# Altium project ProjectAgricultureSensor.PrjPcb
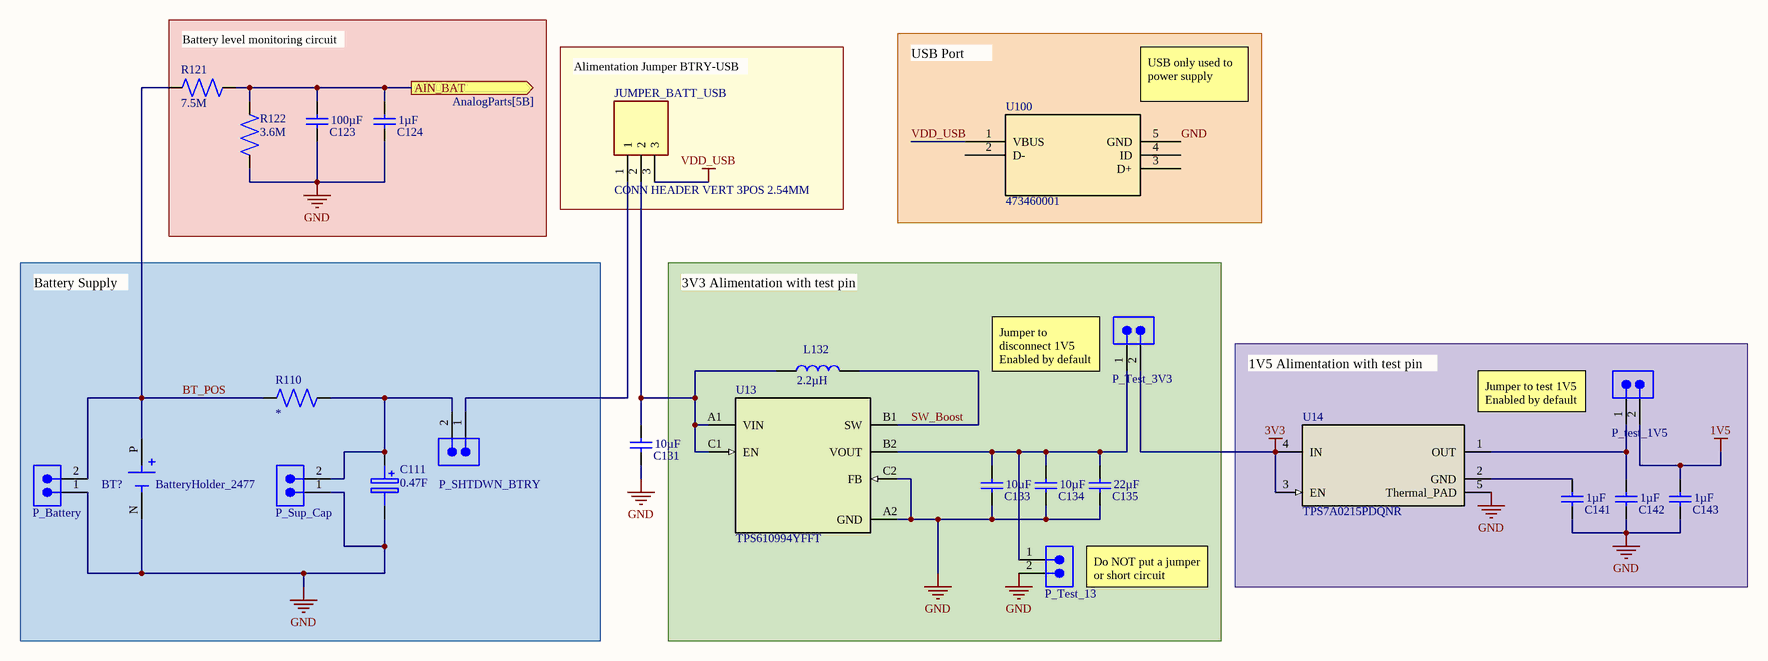
[diagram p0: PowerElectronics.SchDoc]
4 sheets, 150 parts. Net scope: flat (ports and power ports of the same name join across sheets).
Board file: PcbLayout.PcbDoc
Sheets:
  PowerElectronics.SchDoc
  AnalogParts.SchDoc
  Processor.SchDoc
  RF_antenna.SchDoc

## Sheet PowerElectronics.SchDoc
size 381 x 241 mm; SheetNumber: 1; SheetTotal: 4

### Parts
BT?  BatteryHolder_2477  [BatteryHolder2477]
C111  0.47F  [TH_SUPCAP_PHVL3R9V474R]
C123  100µF  [CAPC1608X06L]
C124  1µF  [CAPC1608X06L]
C131  10µF  [CAPC1608X06L]
C133  10µF  [CAPC1608X06L]
C134  10µF  [CAPC1608X06L]
C135  22µF  [CAPC1608X06L]
C141  1µF  [CAPC1608X06L]
C142  1µF  [CAPC1608X06L]
C143  1µF  [CAPC1608X06L]
JUMPER_BATT_USB  CONN HEADER VERT 3POS 2.54MM  [CONN HEADER VERT 3POS 2.54MM]
L132  2.2µH  [INDC2016X10CX]
P_Battery  Pin header 2p  [Pin_header_1x2]  (value not drawn)
P_SHTDWN_BTRY  Pin header 2p  [Pin_header_1x2]  (value not drawn)
P_Sup_Cap  Pin header 2p  [Pin_header_1x2]  (value not drawn)
P_test_1V5  Pin header 2p  [Pin_header_1x2]  (value not drawn)
P_Test_3V3  Pin header 2p  [Pin_header_1x2]  (value not drawn)
P_Test_13  Pin header 2p  [Pin_header_1x2]  (value not drawn)
R110  *  [RESC1608X04.5L]
R121  7.5M  [RESC1608X04.5L]
R122  3.6M  [RESC1608X04.5L]
U13  TPS610994YFFT  [YFF0006AFAD]
U14  TPS7A0215PDQNR  [DQN0004A-MFG]
U100  473460001  [47346-0001_MOL]

### Ports
AIN_BAT (out, see AnalogParts[5B])

### Nets
1V5: C143.2 P_test_1V5.2
3V3: P_Test_3V3.2 U14.3(EN) U14.4(IN)
GND: BT?.N(NEG) C111.1(-) C123.1 C124.1 C131.1 C133.1 C134.1 C135.1 C141.1 C142.1 C143.1 P_Battery.1 P_Sup_Cap.1 P_Test_13.2 R122.2 U13.A2(GND) U13.C2(FB) U14.5(Thermal_PAD) U100.5(GND)
VDD_USB: JUMPER_BATT_USB.3 U100.1(VBUS)
ANALOG1: C123.2 C124.2 R121.2 R122.1 ; port AIN_BAT
BT_POS: BT?.P(POS) P_Battery.2 R110.1 R121.1
SW_Boost: L132.2 U13.B1(SW)
NetC111_2: C111.2(+) P_SHTDWN_BTRY.2 P_Sup_Cap.2 R110.2
NetC131_2: C131.2 JUMPER_BATT_USB.2 L132.1 U13.A1(VIN) U13.C1(EN)
NetC133_2: C133.2 C134.2 C135.2 P_Test_3V3.1 P_Test_13.1 U13.B2(VOUT)
NetC141_2: C141.2 U14.2(GND)
NetC142_2: C142.2 P_test_1V5.1 U14.1(OUT)
NetJUMPER_BATT_USB_1: JUMPER_BATT_USB.1 P_SHTDWN_BTRY.1

Not connected (* = marked no-connect by the designer): U100 2(D-) 3(D+) 4(ID)

### Notes on the sheet
- (near R121) Battery level monitoring circuit
- Alimentation Jumper BTRY-USB
- USB Port
- (near U100) USB only used to power supply
- Battery Supply
- 3V3 Alimentation with test pin
- (near P_Test_3V3) Jumper to disconnect 1V5
  Enabled by default
- 1V5 Alimentation with test pin
- Jumper to test 1V5
  Enabled by default
- Do NOT put a jumper or short circuit

### Library data of the parts
BT? = BatteryHolder_2477: Battery holder for coin battery, modello BH1000G; Value: BatteryHolder_2477
C111 = PHVL-3R9V474-R: Supercapacitors 0.47F, 3.9V working voltage, 5V surge voltage, 1µA leak current; Value: 0.47F
C123 C124 C131 C133-C135 = C0603-4µ7: Capacitor, X5R, ±10%; Value: 4.7µF
C141-C143 = C0603-4µ7: Capacitor, X5R, ±10%; Value: 1µF
JUMPER_BATT_USB = CONN HEADER VERT 3POS 2.54MM: Connector; Manufacturer_Name: Wurth Elektronik; Manufacturer_Part_Number: 61300311121; Datasheet Link: http://katalog.we-online.de/em/datasheet/6130xx11121.pdf; Height: 8.69mm; Mouser Part Number: 710-61300311121; Mouser Price/Stock: https://www.mouser.co.uk/ProductDetail/Wurth-Elektronik/61300311121?qs=PhR8RmCirEYxRWFJzNKsUw%3D%3D
L132 = L0806-2µ2-1.53A-163mOhm-TDK: Shielded wirewound Inductor 1.53 A 163mOhm, ±20%; MF: TDK Corporation; MP: VLS201610CX-2R2M-1; Check_prices: https://www.snapeda.com/parts/VLS201610CX-2R2M-1/TDK/view-part/?ref=eda; Price: None; Availability: In Stock; SnapEDA_Link: https://www.snapeda.com/parts/VLS201610CX-2R2M-1/TDK/view-part/?ref=snap; Value: 2.2µH; Package: NON STANDARD-2 TDK; Purchase-URL: https://pricing.snapeda.com/search/part/VLS201610CX-2R2M-1/?ref=eda
P_Battery P_SHTDWN_BTRY P_Sup_Cap P_test_1V5 P_Test_3V3 P_Test_13 = Pin header 2p: Pin Header, THT, Vertical, pitch 2.54mm, 1 Row, 2P; Value: Pin header 2p
R110 R121 R122 = R0603: Resistor, ±1%, 0.063W; Value: *
U13 = TPS610994YFFT: No Description Available; Mfr_Name: Texas Instruments; TYPE: TYPE; RefDes: RefDes
U14 = TPS7A0215PDQNR: No Description Available; Mfr_Name: Texas Instruments; TYPE: TYPE; RefDes: RefDes
U100 = 473460001: No Description Available; Mfr_Name: Molex Connector Corporation; RefDes: RefDes; Type: Type

## Sheet AnalogParts.SchDoc
size 381 x 241 mm; SheetNumber: 2; SheetTotal: 4
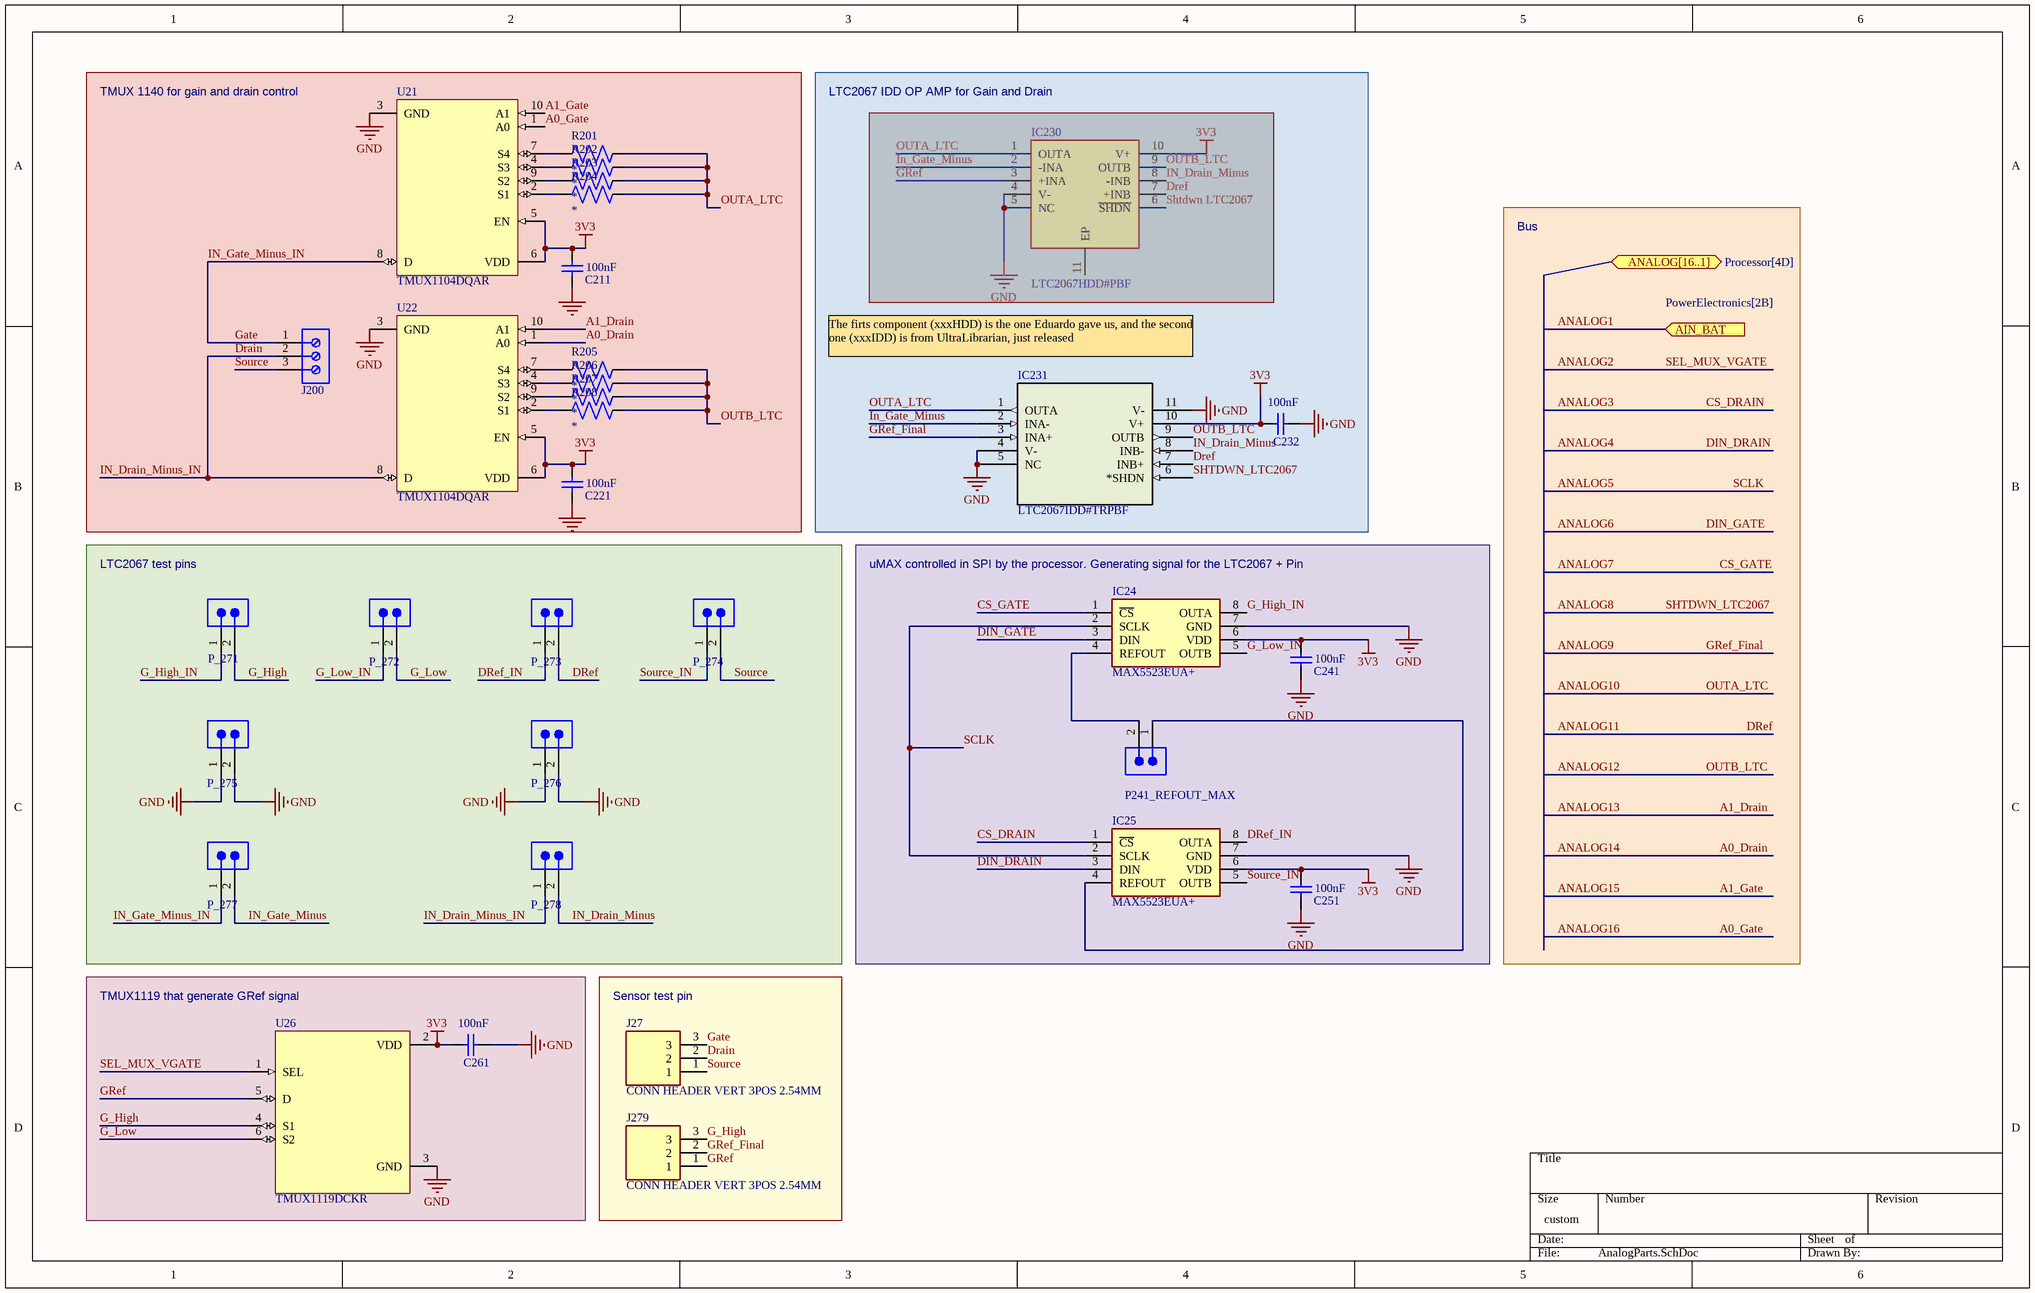
[diagram p1: AnalogParts.SchDoc]

### Parts
C211  100nF  [CAPC1608X06L]
C221  100nF  [CAPC1608X06L]
C232  100nF  [CAPC1608X06L]
C241  100nF  [CAPC1608X06L]
C251  100nF  [CAPC1608X06L]
C261  100nF  [CAPC1608X06L]
IC24  MAX5523EUA+  [MAX5523EUA+]
IC25  MAX5523EUA+  [MAX5523EUA+]
IC230  LTC2067HDD#PBF  [LTC2067HDD#PBF]  (masked out: inside a compile mask, not in the netlist)
IC231  LTC2067IDD#TRPBF  [05-08-1699_ADI]
J27  CONN HEADER VERT 3POS 2.54MM  [CONN HEADER VERT 3POS 2.54MM]
J200  691210910003  [CONN_3P_691210910003]  (value not drawn)
J279  CONN HEADER VERT 3POS 2.54MM  [CONN HEADER VERT 3POS 2.54MM]
P241_REFOUT_MAX  Pin header 2p  [Pin_header_1x2]  (value not drawn)
P_271  Pin header 2p  [Pin_header_1x2]  (value not drawn)
P_272  Pin header 2p  [Pin_header_1x2]  (value not drawn)
P_273  Pin header 2p  [Pin_header_1x2]  (value not drawn)
P_274  Pin header 2p  [Pin_header_1x2]  (value not drawn)
P_275  Pin header 2p  [Pin_header_1x2]  (value not drawn)
P_276  Pin header 2p  [Pin_header_1x2]  (value not drawn)
P_277  Pin header 2p  [Pin_header_1x2]  (value not drawn)
P_278  Pin header 2p  [Pin_header_1x2]  (value not drawn)
R201  *  [RESC1608X04.5L]
R202  *  [RESC1608X04.5L]
R203  *  [RESC1608X04.5L]
R204  *  [RESC1608X04.5L]
R205  *  [RESC1608X04.5L]
R206  *  [RESC1608X04.5L]
R207  *  [RESC1608X04.5L]
R208  *  [RESC1608X04.5L]
U21  TMUX1104DQAR  [TMUX1104DQAR]
U22  TMUX1104DQAR  [TMUX1104DQAR]
U26  TMUX1119DCKR  [SC70_200X125_6N]

### Blocks framed on the sheet
TMUX 1140 for gain and drain control: C211 C221 J200 R201-R208 U21 U22
LTC2067 IDD OP AMP for Gain and Drain: C232 IC230 IC231
LTC2067 test pins: P_271-P_278
TMUX1119 that generate GRef signal: C261 U26
Sensor test pin: J27 J279

### Ports
AIN_BAT (in, see PowerElectronics[2B]), ANALOG[16..1] (bidir, see Processor[4D])

### Nets
3V3: C211.1 C221.1 C232.1 C241.1 C251.1 C261.1 IC24.6(VDD) IC25.6(VDD) IC231.10(V+) U21.5(EN) U21.6(VDD) U22.5(EN) U22.6(VDD) U26.2(VDD)
GND: C211.2 C221.2 C232.2 C241.2 C251.2 C261.2 IC24.7(GND) IC25.7(GND) IC231.4(V-) IC231.5(NC) IC231.11(V-) P_275.1 P_275.2 P_276.1 P_276.2 U21.3(GND) U22.3(GND) U26.3(GND)
A0_Drain: U22.1(A0)  [also labelled ANALOG14]
A0_Gate: U21.1(A0)  [also labelled ANALOG16]
A1_Drain: U22.10(A1)  [also labelled ANALOG13]
A1_Gate: U21.10(A1)  [also labelled ANALOG15]
ANALOG2: U26.1(SEL)  [also labelled SEL_MUX_VGATE]
ANALOG3: IC25.1(~{CS})  [also labelled CS_DRAIN]
ANALOG4: IC25.3(DIN)  [also labelled DIN_DRAIN]
ANALOG5: IC24.2(SCLK) IC25.2(SCLK)  [also labelled SCLK]
ANALOG6: IC24.3(DIN)  [also labelled DIN_GATE]
ANALOG7: IC24.1(~{CS})  [also labelled CS_GATE]
ANALOG8: IC231.6(*SHDN)  [also labelled SHTDWN_LTC2067]
ANALOG9: IC231.3(INA+) J279.2  [also labelled GRef_Final]
ANALOG10: IC231.1(OUTA) R201.2 R202.2 R203.2 R204.2  [also labelled OUTA_LTC]
ANALOG11: IC231.7(INB+) P_273.2  [also labelled Dref]
ANALOG12: IC231.9(OUTB) R205.2 R206.2 R207.2 R208.2  [also labelled OUTB_LTC]
Drain: J27.2 J200.2 P_278.1 U22.8(D)  [also labelled IN_Drain_Minus_IN]
DRef_IN: IC25.8(OUTA) P_273.1
G_High: J279.3 P_271.2 U26.4(S1)
G_High_IN: IC24.8(OUTA) P_271.1
G_Low: P_272.2 U26.6(S2)
G_Low_IN: IC24.5(OUTB) P_272.1
Gate: J27.3 J200.1 P_277.1 U21.8(D)  [also labelled IN_Gate_Minus_IN]
GRef: J279.1 U26.5(D)
IN_Drain_Minus: IC231.8(INB-) P_278.2
In_Gate_Minus: IC231.2(INA-) P_277.2
Source: J27.1 J200.3 P_274.2
Source_IN: IC25.5(OUTB) P_274.1
NetIC24_4: IC24.4(REFOUT) P241_REFOUT_MAX.2
NetIC25_4: IC25.4(REFOUT) P241_REFOUT_MAX.1
NetR201_1: R201.1 U21.7(S4)
NetR202_1: R202.1 U21.4(S3)
NetR203_1: R203.1 U21.9(S2)
NetR204_1: R204.1 U21.2(S1)
NetR205_1: R205.1 U22.7(S4)
NetR206_1: R206.1 U22.4(S3)
NetR207_1: R207.1 U22.9(S2)
NetR208_1: R208.1 U22.2(S1)

### Notes on the sheet
- Bus
- The firts component (xxxHDD) is the one Eduardo gave us, and the second one (xxxIDD) is from UltraLibrarian, just released
- (near IC24) uMAX controlled in SPI by the processor. Generating signal for the LTC2067 + Pin

### Library data of the parts
C211 C221 C232 C241 C251 C261 = C0603-4µ7: Capacitor, X5R, ±10%; Value: 4.7µF
IC24 IC25 = MAX5523EUA+: Integrated Circuit; Manufacturer_Name: Analog Devices; Datasheet Link: https://pdfserv.maximintegrated.com/en/ds/MAX5522-MAX5525.pdf; Height: 1.1mm; Manufacturer_Part_Number: MAX5523EUA+; Mouser Part Number: 700-MAX5523EUA; Mouser Price/Stock: https://www.mouser.co.uk/ProductDetail/Analog-Devices-Maxim-Integrated/MAX5523EUA%2b?qs=9Cj2FLRihcNj5G7tv6WL1A%3D%3D
IC230 = LTC2067HDD#PBF: Integrated Circuit; Manufacturer_Name: Analog Devices; Datasheet Link: https://datasheet.datasheetarchive.com/originals/distributors/DKDS41/DSANUWW0020938.pdf; Height: 0.8mm; Manufacturer_Part_Number: LTC2067HDD#PBF; Mouser Part Number: 584-LTC2067HDD#PBF; Mouser Price/Stock: https://www.mouser.com/Search/Refine.aspx?Keyword=584-LTC2067HDD%23PBF; Arrow Part Number: LTC2067HDD#PBF; Arrow Price/Stock: https://www.arrow.com/en/products/ltc2067hddpbf/analog-devices
IC231 = LTC2067IDD#TRPBF: No Description Available; Mfr_Name: Analog Devices Inc; Type: Linear; RefDes: RefDes
J27 J279 = CONN HEADER VERT 3POS 2.54MM: as JUMPER_BATT_USB on sheet PowerElectronics; Datasheet Link: http://katalog.we-online.de/em/datasheet/6130xx11121.pdf; Height: 8.69mm; Mouser Part Number: 710-61300311121; Mouser Price/Stock: https://www.mouser.co.uk/ProductDetail/Wurth-Elektronik/61300311121?qs=PhR8RmCirEYxRWFJzNKsUw%3D%3D
J200 = CONN_3P_691210910003: WR-TBL Series 2109 Horizontal Entry, THT, pitch 2.54mm, 3p; Manufacturer: Wurth Elektronik; Modularity: No; Rated Current: 6A; Working Voltage: 150V; ComponentLink1Description: Website Link; ComponentLink1URL: https://www.we-online.com/redexpert/article/691210910003?ad; ComponentLink2Description: Datasheet Link; ComponentLink2URL: https://www.we-online.com/redexpert/spec/691210910003?ad; Manufacturer Part Number: 691210910003; Category: Terminal Blocks; Match Code: WR-TBL; Mount: Through Hole; Operating Temperature Max: 105°C; Operating Temperature Min: -40°C; Packaging: Box; Application: Rising Cage Clamp; Number of Pins: 3; Number of Rows: 1; Orientation: Horizontal; Pitch: 2.54mm
P241_REFOUT_MAX P_271-P_278 = Pin header 2p: as P_Battery on sheet PowerElectronics; Value: Pin header 2p
R201-R208 = R0603: Resistor, ±1%, 0.063W; Value: *
U21 U22 = TMUX1104DQAR: Multiplexer 4:1, 3-pA on-state leakage current, 1.08v - 5V supply range; Value: TMUX1104DQAR
U26 = TMUX1119DCKR: 2:1 precision switch, low leakage current, 1.08v - 5V supply range; MF: Texas Instruments; Texas_Instruments-Purchase-URL: https://snapeda.com/shop?store=Texas+Instruments&id=3222194; Package: SOT-SC70-6 Texas Instruments; MP: TMUX1119DCKR; Value: TMUX1119DCKR; SnapEDA_Link: https://www.snapeda.com/parts/TMUX1119DCKR/Texas%20Instruments/view-part/3222194/?ref=snap; Price: None; Availability: Unavailable

## Sheet Processor.SchDoc
size A2; SheetNumber: 3; SheetTotal: 4
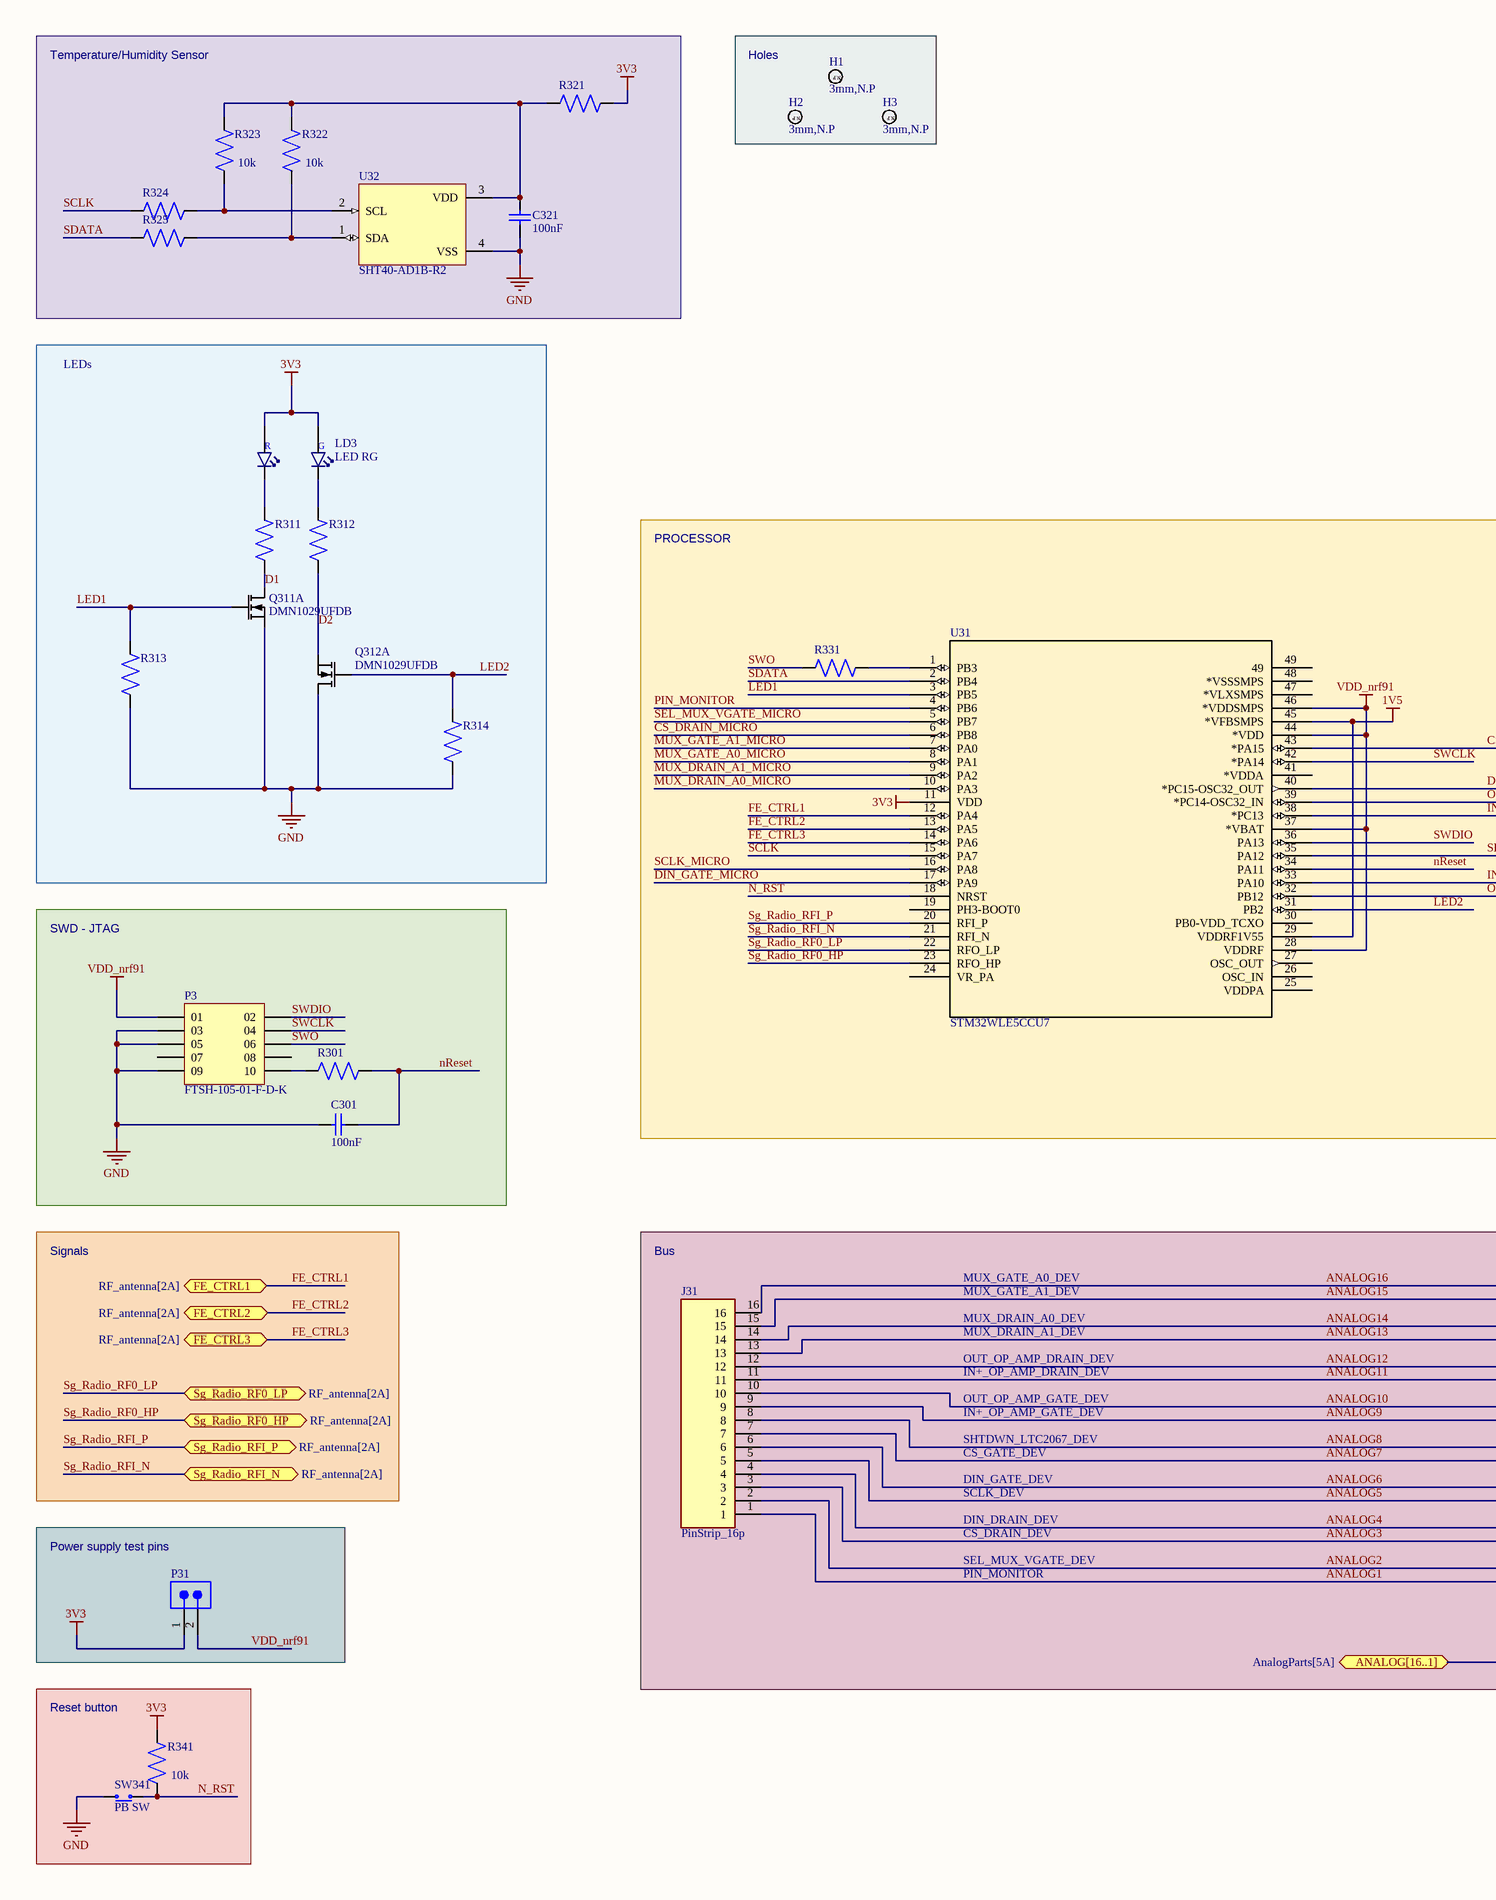
[diagram p2: Processor.SchDoc, left]
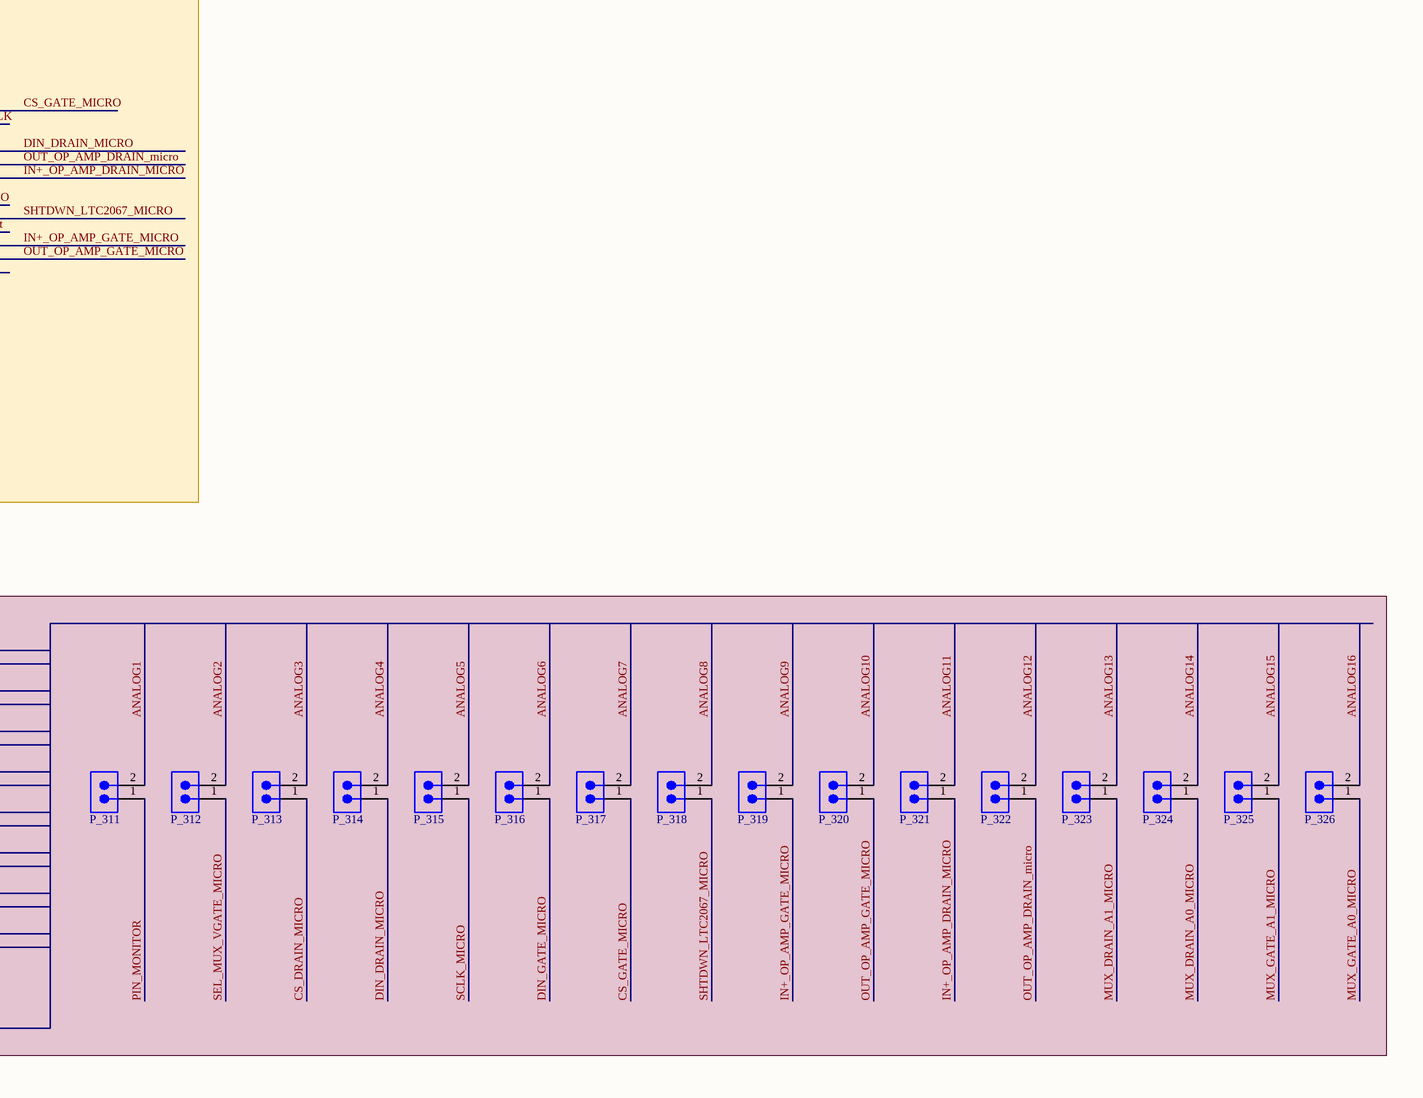
[diagram p3: Processor.SchDoc, right]

### Parts
C301  100nF  [CAPC1608X06L]
C321  100nF  [CAPC1608X06L]
H1  3mm,N.P  [HOLE_NP_3MM]  (no BOM)
H2  3mm,N.P  [HOLE_NP_3MM]  (no BOM)
H3  3mm,N.P  [HOLE_NP_3MM]  (no BOM)
J31  PinStrip_16p  [PinStrip_16p]
LD3  LED RG  [LED_RGB_0805]
P3  FTSH-105-01-F-D-K  [HDR_2x5-THT-1.27mm-K]
P31  Pin header 2p  [Pin_header_1x2]  (value not drawn)
P_311  Pin header 2p  [Pin_header_1x2]  (value not drawn)
P_312  Pin header 2p  [Pin_header_1x2]  (value not drawn)
P_313  Pin header 2p  [Pin_header_1x2]  (value not drawn)
P_314  Pin header 2p  [Pin_header_1x2]  (value not drawn)
P_315  Pin header 2p  [Pin_header_1x2]  (value not drawn)
P_316  Pin header 2p  [Pin_header_1x2]  (value not drawn)
P_317  Pin header 2p  [Pin_header_1x2]  (value not drawn)
P_318  Pin header 2p  [Pin_header_1x2]  (value not drawn)
P_319  Pin header 2p  [Pin_header_1x2]  (value not drawn)
P_320  Pin header 2p  [Pin_header_1x2]  (value not drawn)
P_321  Pin header 2p  [Pin_header_1x2]  (value not drawn)
P_322  Pin header 2p  [Pin_header_1x2]  (value not drawn)
P_323  Pin header 2p  [Pin_header_1x2]  (value not drawn)
P_324  Pin header 2p  [Pin_header_1x2]  (value not drawn)
P_325  Pin header 2p  [Pin_header_1x2]  (value not drawn)
P_326  Pin header 2p  [Pin_header_1x2]  (value not drawn)
Q311  DMN1029UFDB  [MOSFET_DMP2160UFDB-7]  (part A of 2)
Q312  DMN1029UFDB  [MOSFET_DMP2160UFDB-7]  (part A of 2)
R301  (no value)  [RESC1608X04.5L]
R311  (no value)  [RESC1608X04.5L]
R312  (no value)  [RESC1608X04.5L]
R313  (no value)  [RESC1608X04.5L]
R314  (no value)  [RESC1608X04.5L]
R321  (no value)  [RESC1608X04.5L]
R322  10k  [RESC1608X04.5L]
R323  10k  [RESC1608X04.5L]
R324  (no value)  [RESC1608X04.5L]
R325  (no value)  [RESC1608X04.5L]
R331  (no value)  [RESC1608X04.5L]
R341  10k  [RESC1608X04.5L]
SW341  PB SW  [Switch-PB-6.2x6.3mm-SMD]
U31  STM32WLE5CCU7  [UFQFPN_5CCU7_STM]
U32  SHT40-AD1B-R2  [SHT4X]

### Blocks framed on the sheet
Temperature/Humidity Sensor: C321 R321-R325 U32
Holes: H1-H3
LEDs: LD3 Q311 Q312 R311-R314
PROCESSOR: R331 U31
SWD - JTAG: C301 P3 R301
Power supply test pins: P31
Reset button: R341 SW341

### Ports
ANALOG[16..1] (bidir, see AnalogParts[5A]), FE_CTRL1 (bidir, see RF_antenna[2A]), FE_CTRL2 (bidir, see RF_antenna[2A]), FE_CTRL3 (bidir, see RF_antenna[2A]), Sg_Radio_RF0_HP (bidir, see RF_antenna[2A]), Sg_Radio_RF0_LP (bidir, see RF_antenna[2A]), Sg_Radio_RFI_N (bidir, see RF_antenna[2A]), Sg_Radio_RFI_P (bidir, see RF_antenna[2A])

### Nets
1V5: U31.29(VDDRF1V55) U31.45(*VFBSMPS)
3V3: LD3.3(A_RED) LD3.4(A_GREEN) P31.1 R321.2 R341.2 U31.11(VDD)
GND: C301.2 C321.1 P3.03 P3.05 P3.09 Q311.1(S1) Q312.6(D1) R313.1 R314.1 SW341.1(N.O) U32.4(VSS)
VDD_nrf91: P3.01 P31.2 U31.28(VDDRF) U31.37(*VBAT) U31.44(*VDD) U31.46(*VDDSMPS)
ANALOG1: J31.1 P_311.2
ANALOG2: J31.2 P_312.2
ANALOG3: J31.3 P_313.2
ANALOG4: J31.4 P_314.2
ANALOG5: J31.5 P_315.2
ANALOG6: J31.6 P_316.2
ANALOG7: J31.7 P_317.2
ANALOG8: J31.8 P_318.2
ANALOG9: J31.9 P_319.2
ANALOG10: J31.10 P_320.2
ANALOG11: J31.11 P_321.2
ANALOG12: J31.12 P_322.2
ANALOG13: J31.13 P_323.2
ANALOG14: J31.14 P_324.2
ANALOG15: J31.15 P_325.2
ANALOG16: J31.16 P_326.2
CS_DRAIN_MICRO: P_313.1 U31.6(PB8)
CS_GATE_MICRO: P_317.1 U31.43(*PA15)
D1: Q311.6(D1) R311.1
D2: Q312.1(S1) R312.1
DIN_DRAIN_MICRO: P_314.1 U31.40(*PC15-OSC32_OUT)
DIN_GATE_MICRO: P_316.1 U31.17(PA9)
FE_CTRL1: U31.12(PA4) ; port FE_CTRL1
FE_CTRL2: U31.13(PA5) ; port FE_CTRL2
FE_CTRL3: U31.14(PA6) ; port FE_CTRL3
IN+_OP_AMP_DRAIN_MICRO: P_321.1 U31.38(*PC13)
IN+_OP_AMP_GATE_MICRO: P_319.1 U31.33(PA10)
LED1: Q311.2(G1) R313.2 U31.3(PB5)
LED2: Q312.2(G1) R314.2 U31.31(PB2)
MUX_DRAIN_A0_MICRO: P_324.1 U31.10(PA3)
MUX_DRAIN_A1_MICRO: P_323.1 U31.9(PA2)
MUX_GATE_A0_MICRO: P_326.1 U31.8(PA1)
MUX_GATE_A1_MICRO: P_325.1 U31.7(PA0)
N_RST: R341.1 SW341.2(COM) U31.18(NRST)
nReset: C301.1 R301.2 U31.34(PA11)
OUT_OP_AMP_DRAIN_micro: P_322.1 U31.39(*PC14-OSC32_IN)
OUT_OP_AMP_GATE_MICRO: P_320.1 U31.32(PB12)
PIN_MONITOR: P_311.1 U31.4(PB6)
SCLK: R324.1 U31.15(PA7)
SCLK_MICRO: P_315.1 U31.16(PA8)
SDATA: R325.1 U31.2(PB4)
SEL_MUX_VGATE_MICRO: P_312.1 U31.5(PB7)
Sg_Radio_RF0_HP: U31.23(RFO_HP) ; port Sg_Radio_RF0_HP
Sg_Radio_RF0_LP: U31.22(RFO_LP) ; port Sg_Radio_RF0_LP
Sg_Radio_RFI_N: U31.21(RFI_N) ; port Sg_Radio_RFI_N
Sg_Radio_RFI_P: U31.20(RFI_P) ; port Sg_Radio_RFI_P
SHTDWN_LTC2067_MICRO: P_318.1 U31.35(PA12)
SWCLK: P3.04 U31.42(*PA14)
SWDIO: P3.02 U31.36(PA13)
SWO: P3.06 R331.1
NetC321_2: C321.2 R321.1 R322.2 R323.2 U32.3(VDD)
NetLD3_1: LD3.1(C_GREEN) R312.2
NetLD3_2: LD3.2(C_RED) R311.2
NetP3_10: P3.10 R301.1
NetR322_1: R322.1 R325.2 U32.1(SDA)
NetR323_1: R323.1 R324.2 U32.2(SCL)
NetR331_2: R331.2 U31.1(PB3)

Not connected (* = marked no-connect by the designer): P3 07 08; U31 19(PH3-BOOT0) 24(VR_PA) 25(VDDPA) 26(OSC_IN) 27(OSC_OUT) 30(PB0-VDD_TCXO) 41(*VDDA) 47(*VLXSMPS) 48(*VSSSMPS) 49

### Notes on the sheet
- Signals
- Bus
- MUX_GATE_A0_DEV
- MUX_GATE_A1_DEV
- MUX_DRAIN_A0_DEV
- MUX_DRAIN_A1_DEV
- OUT_OP_AMP_DRAIN_DEV
- IN+_OP_AMP_DRAIN_DEV
- OUT_OP_AMP_GATE_DEV
- IN+_OP_AMP_GATE_DEV
- SHTDWN_LTC2067_DEV
- CS_GATE_DEV
- DIN_GATE_DEV
- SCLK_DEV
- DIN_DRAIN_DEV
- CS_DRAIN_DEV
- SEL_MUX_VGATE_DEV
- PIN_MONITOR
- (in symbol APHBM2012LSURKZGKC) R; G
- (in symbol Hole_3MM_NP) N.P

### Library data of the parts
C301 C321 = C0603-4µ7: Capacitor, X5R, ±10%; Value: 100nF
H1-H3 = Hole_3MM_NP: Regular Non-Plated, 3mm hole; Value: 3mm,N.P
J31 = PinStrip_16p: Connector; Manufacturer_Name: Adam Tech; Manufacturer_Part_Number: PH1-16-UA; Datasheet Link: https://www.arrow.com/en/products/ph1-16-ua/adam-tech; Height: 8.469mm; Arrow Part Number: PH1-16-UA; Arrow Price/Stock: https://www.arrow.com/en/products/ph1-16-ua/adam-tech?region=nac
LD3 = APHBM2012LSURKZGKC: Red green LED 2 mm x 1.25 mm SMD; Value: LED RG
P3 = Pin Header 2x5 THT, 1.27mm KS: Connector Header Through Hole 10 position 0.050 (1.27mm); MF: Samtec; Value: FTSH-105-01-F-D-K; Price: None; Toby_UK-Purchase-URL: https://snapeda.com/shop?store=Toby+UK&id=229423; Package: None; SnapEDA_Link: https://www.snapeda.com/parts/FTSH-105-01-F-D-K/Samtec%20Inc./view-part/229423/?ref=snap; Availability: Bad; MP: FTSH-105-01-F-D-K
P31 P_311-P_326 = Pin header 2p: as P_Battery on sheet PowerElectronics; Value: Pin header 2p
Q311 Q312 = DMN1029UFDB: Dual N Ch MOFET, 5.6A, 29mOhm max, 1.4W; Value: DMN1029UFDB
R301 R311-R314 R321 R324 R325 R331 = R0603: Resistor, ±1%, 0.063W; Value: *
R322 R341 = R0603: Resistor, ±1%, 0.063W; Value: 10K ohm
R323 = R0603: Resistor, ±1%, 0.063W; Value: 10k ohm
SW341 = Switch-PB-6.2x6.3mm-SMD: Tactile Switch, SPNO, SMD, 160gf, 6.2x6.3x2.5mm; Value: PB SW
U31 = STM32WLE5CCU7: No Description Available; Mfr_Name: STMicroelectronics; RefDes: RefDes; Type: Type
U32 = SHT40-AD1B-R2: Humidity/Temperature Sensor Digital Serial (I2C) 4-Pin DFN EP T/R; MF: Sensirion AG; Package: None; Value: SHT40-AD1B-R2; Purchase-URL: https://pricing.snapeda.com/search/part/SHT40-AD1B-R2/?ref=eda; Availability: In Stock; MP: SHT40-AD1B-R2; Check_prices: https://www.snapeda.com/parts/SHT40-AD1B-R2/NSI/view-part/?ref=eda; SnapEDA_Link: https://www.snapeda.com/parts/SHT40-AD1B-R2/NSI/view-part/?ref=snap; Price: None

## Sheet RF_antenna.SchDoc
size A3; SheetNumber: 4; SheetTotal: 4
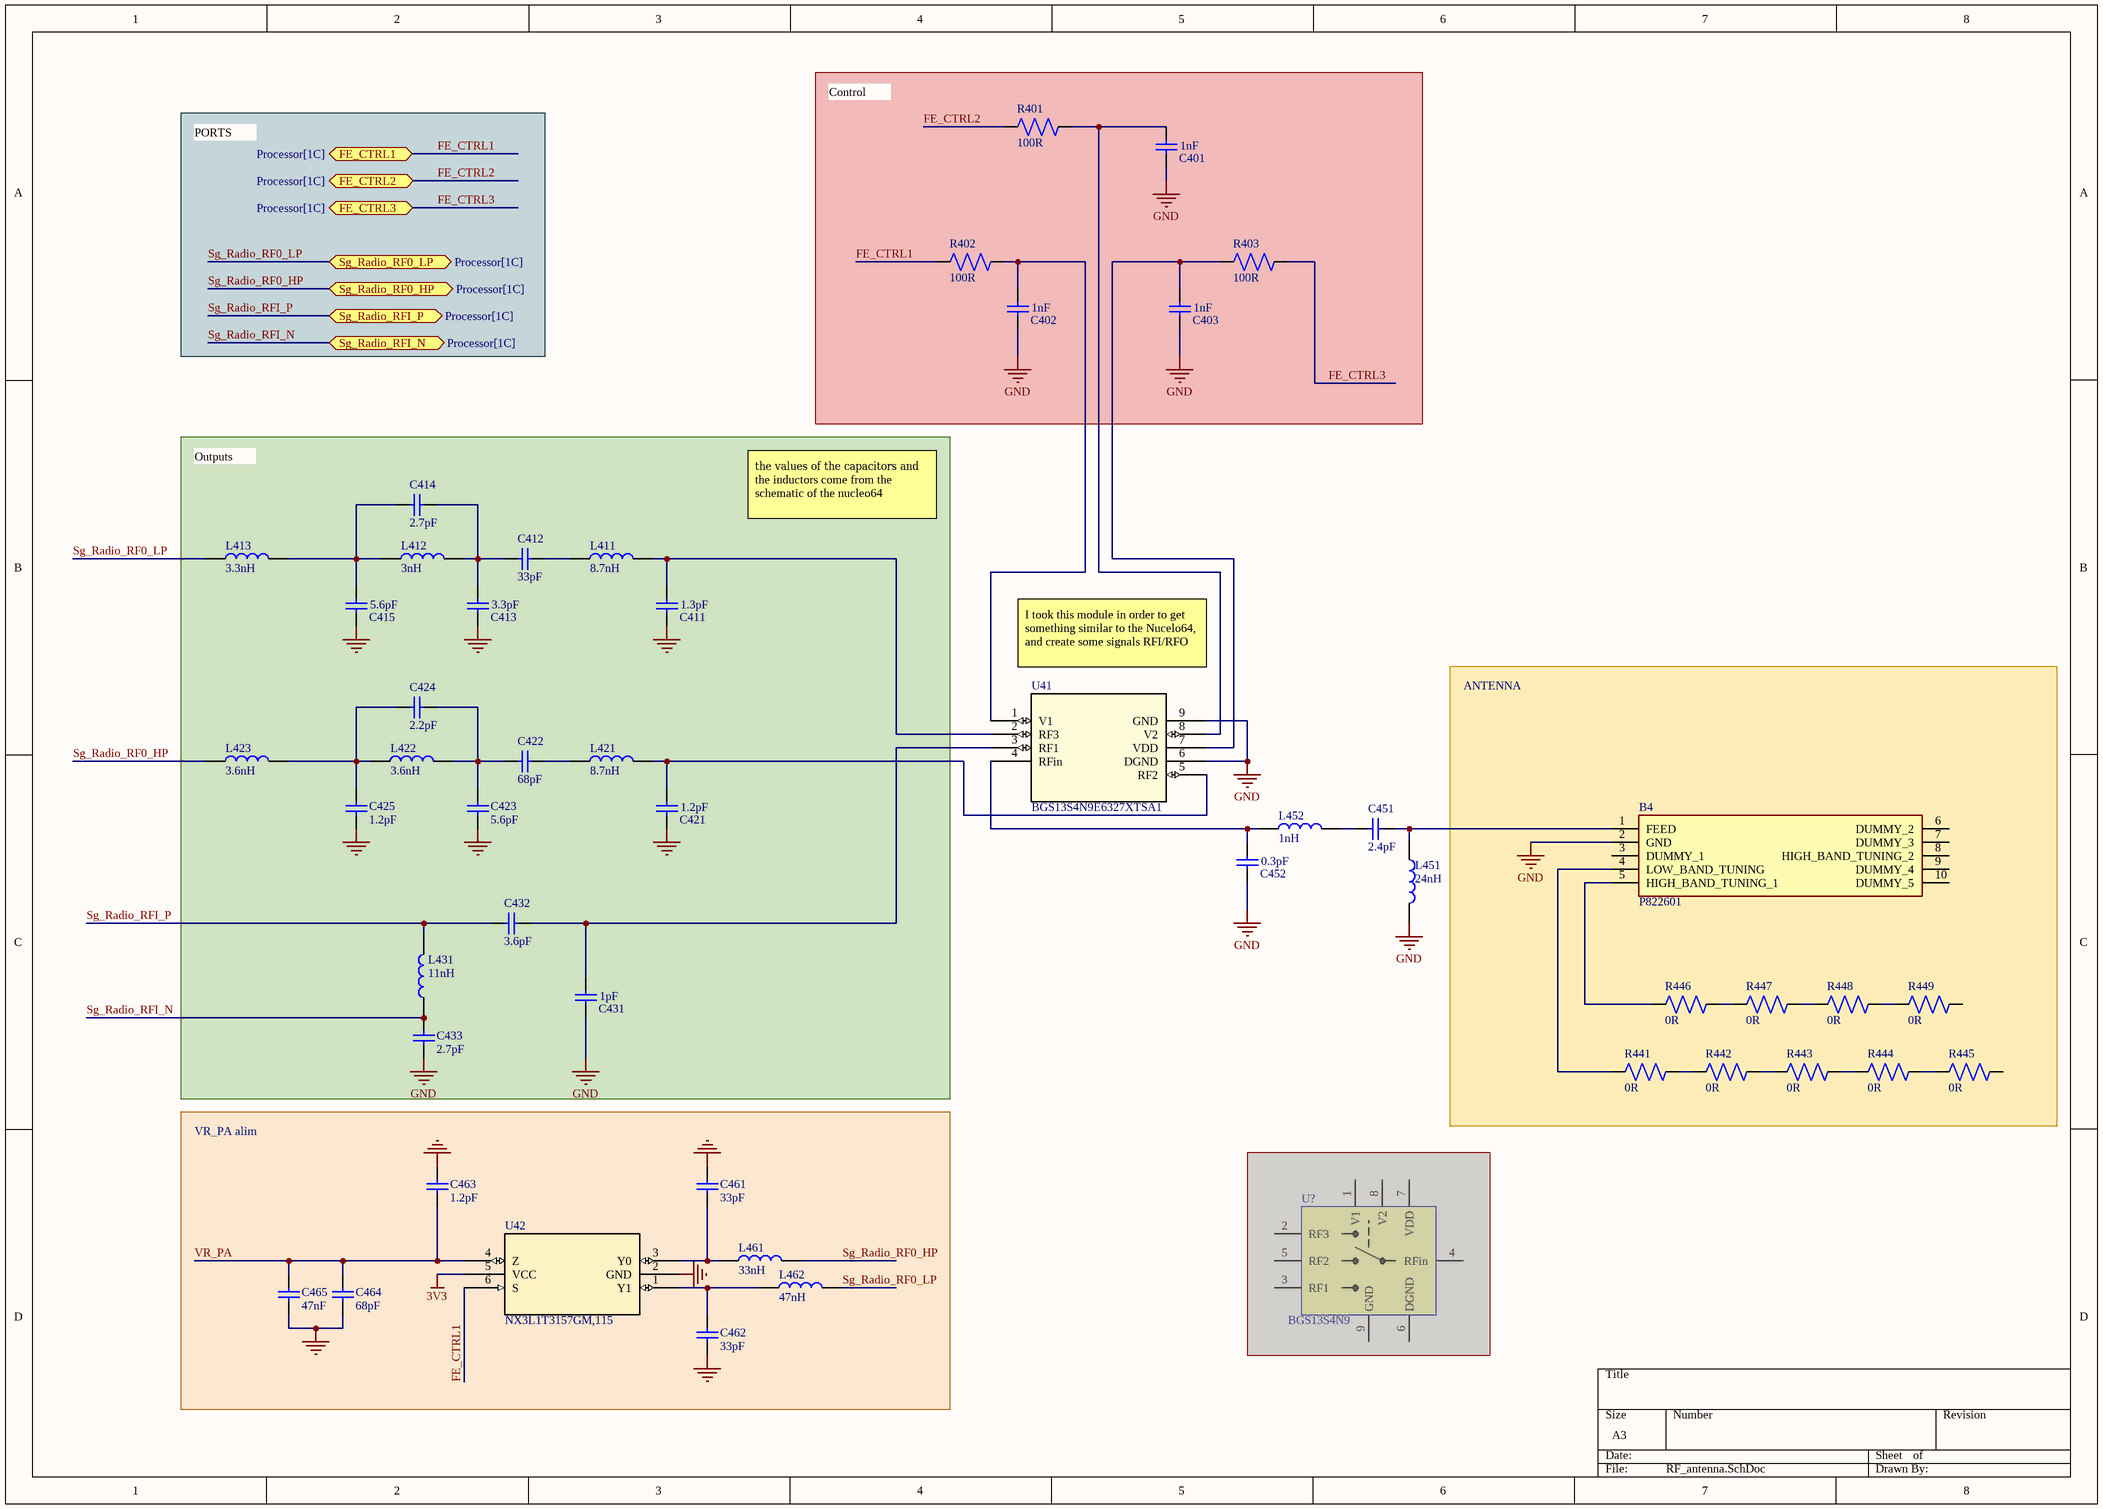
[diagram p4: RF_antenna.SchDoc]

### Parts
B4  P822601  [P822601]
C401  1nF  [CAPC1608X06L]
C402  1nF  [CAPC1608X06L]
C403  1nF  [CAPC1608X06L]
C411  1.3pF  [CAPC1608X06L]
C412  33pF  [CAPC1608X06L]
C413  3.3pF  [CAPC1608X06L]
C414  2.7pF  [CAPC1608X06L]
C415  5.6pF  [CAPC1608X06L]
C421  1.2pF  [CAPC1608X06L]
C422  68pF  [CAPC1608X06L]
C423  5.6pF  [CAPC1608X06L]
C424  2.2pF  [CAPC1608X06L]
C425  1.2pF  [CAPC1608X06L]
C431  1pF  [CAPC1608X06L]
C432  3.6pF  [CAPC1608X06L]
C433  2.7pF  [CAPC1608X06L]
C451  2.4pF  [CAPC1608X06L]
C452  0.3pF  [CAPC1608X06L]
C461  33pF  [CAPC1608X06L]
C462  33pF  [CAPC1608X06L]
C463  1.2pF  [CAPC1608X06L]
C464  68pF  [CAPC1608X06L]
C465  47nF  [CAPC1608X06L]
L411  8.7nH  [INDC1608X06L_WW]
L412  3nH  [INDC1608X06L_WW]
L413  3.3nH  [INDC1608X06L_WW]
L421  8.7nH  [INDC1608X06L_WW]
L422  3.6nH  [INDC1608X06L_WW]
L423  3.6nH  [INDC1608X06L_WW]
L431  11nH  [INDC1608X06L_WW]
L451  24nH  [INDC1608X06L_WW]
L452  1nH  [INDC1608X06L_WW]
L461  33nH  [INDC1608X06L_WW]
L462  47nH  [INDC1608X06L_WW]
R401  100R  [RESC1608X04.5L]
R402  100R  [RESC1608X04.5L]
R403  100R  [RESC1608X04.5L]
R441  0R  [RESC1608X04.5L]
R442  0R  [RESC1608X04.5L]
R443  0R  [RESC1608X04.5L]
R444  0R  [RESC1608X04.5L]
R445  0R  [RESC1608X04.5L]
R446  0R  [RESC1608X04.5L]
R447  0R  [RESC1608X04.5L]
R448  0R  [RESC1608X04.5L]
R449  0R  [RESC1608X04.5L]
U41  BGS13S4N9E6327XTSA1  [TSNP-9-3_INF]
U42  NX3L1T3157GM,115  [XSON6_SOT886_NXP]
U?  value BGS13S4N9  [ICC_TSNP-9-3_1P1X1P1_P040]  (masked out: inside a compile mask, not in the netlist)

### Blocks framed on the sheet
ANTENNA: B4 R441-R449
VR_PA alim: C461-C465 L461 L462 U42

### Ports
FE_CTRL1 (bidir, see Processor[1C]), FE_CTRL2 (bidir, see Processor[1C]), FE_CTRL3 (bidir, see Processor[1C]), Sg_Radio_RF0_HP (bidir, see Processor[1C]), Sg_Radio_RF0_LP (bidir, see Processor[1C]), Sg_Radio_RFI_N (bidir, see Processor[1C]), Sg_Radio_RFI_P (bidir, see Processor[1C])

### Nets
3V3: U42.5(VCC)
GND: B4.2(GND) C401.1 C402.1 C403.1 C411.1 C413.1 C415.1 C421.1 C423.2 C425.2 C431.1 C433.2 C452.1 C461.1 C462.2 C463.2 C464.2 C465.2 L451.2 U41.6(DGND) U41.9(GND) U42.2(GND)
FE_CTRL1: R402.1 U42.6(S) ; port FE_CTRL1
FE_CTRL2: R401.1 ; port FE_CTRL2
FE_CTRL3: R403.2 ; port FE_CTRL3
Sg_Radio_RF0_HP: L423.1 L461.2 ; port Sg_Radio_RF0_HP
Sg_Radio_RF0_LP: L413.1 L462.2 ; port Sg_Radio_RF0_LP
Sg_Radio_RFI_N: C433.1 L431.1 ; port Sg_Radio_RFI_N
Sg_Radio_RFI_P: C432.2 L431.2 ; port Sg_Radio_RFI_P
VR_PA: C463.1 C464.1 C465.1 U42.4(Z)
NetB4_1: B4.1(FEED) C451.1 L451.1
NetB4_4: B4.4(LOW_BAND_TUNING) R441.1
NetB4_5: B4.5(HIGH_BAND_TUNING_1) R446.1
NetC401_2: C401.2 R401.2 U41.8(V2)
NetC402_2: C402.2 R402.2 U41.1(V1)
NetC403_2: C403.2 R403.1 U41.7(VDD)
NetC411_2: C411.2 L411.2 U41.2(RF3)
NetC412_1: C412.1 L411.1
NetC412_2: C412.2 C413.2 C414.1 L412.2
NetC414_2: C414.2 C415.2 L412.1 L413.2
NetC421_2: C421.2 L421.2 U41.5(RF2)
NetC422_1: C422.1 L421.1
NetC422_2: C422.2 C423.1 C424.1 L422.2
NetC424_2: C424.2 C425.1 L422.1 L423.2
NetC431_2: C431.2 C432.1 U41.3(RF1)
NetC451_2: C451.2 L452.2
NetC452_2: C452.2 L452.1 U41.4(RFin)
NetC461_2: C461.2 L461.1 U42.3(Y0)
NetC462_1: C462.1 L462.1 U42.1(Y1)
NetR441_2: R441.2 R442.1
NetR442_2: R442.2 R443.1
NetR443_2: R443.2 R444.1
NetR444_2: R444.2 R445.1
NetR446_2: R446.2 R447.1
NetR447_2: R447.2 R448.1
NetR448_2: R448.2 R449.1

Not connected (* = marked no-connect by the designer): B4 3(DUMMY_1) 6(DUMMY_2) 7(DUMMY_3) 8(HIGH_BAND_TUNING_2) 9(DUMMY_4) 10(DUMMY_5); R445 2; R449 2

### Notes on the sheet
- Control
- PORTS
- Outputs
- the values ​​of the capacitors and the inductors come from the schematic of the nucleo64
- I took this module in order to get something similar to the Nucelo64, and create some signals RFI/RFO

### Library data of the parts
B4 = P822601: AVX - P822601 - EMBEDDED ANTENNA, 1.7-2.7GHZ, 3.4DBI; Geometry.Height: 3.5mm; Mouser Part Number: 581-P822601; Mouser Price/Stock: https://www.mouser.co.uk/ProductDetail/AVX/P822601?qs=vdi0iO8H4N0igrTLYxGIXg%3D%3D; Manufacturer_Name: AVX; Manufacturer_Part_Number: P822601; Datasheet Link: http://datasheets.avx.com/ethertronics/AVX-E_P822601-P822602.pdf
C401-C403 C411-C415 C421-C425 C431-C433 C451 C452 C461 C463-C465 = C0603-4µ7: Capacitor, X5R, ±10%
  C401-C403: Value: 1nF
  C411: Value: 1.3pF
  C412 C461: Value: 33pF
  C413: Value: 3.3pF
  C414 C433: Value: 2.7pF
  C415 C423: Value: 5.6pF
  C421 C425 C463: Value: 1.2pF
  C422 C464: Value: 68pF
  C424: Value: 2.2pF
  C431: Value: 1pF
  C432: Value: 3.6pF
  C451: Value: 2.4pF
  C452: Value: 0.3pF
  C465: Value: 47nF
C462 = C0603-4µ7: Capacitor, X5R, ±10%; Value: 2.4pF
L411 L412 L421-L423 L431 L451 L452 L461 L462 = L0603-33n-Wirewound-Murata: Inductor, 420mA, ±5%, 230mΩ, Q=40
  L411 L421: Value: 8.7nH
  L412: Value: 3nH
  L422 L423: Value: 3.6nH
  L431: Value: 11nH
  L451: Value: 24nH
  L452: Value: 1nH
  L461: Value: 33nH
  L462: Value: 47nH
L413 = L0603-33n-Wirewound-Murata: Inductor, 420mA, ±5%, 230mΩ, Q=40; Value: 3nH
R401-R403 = R0603: Resistor, ±1%, 0.063W; Value: 100
R441-R449 = R0603: Resistor, ±1%, 0.063W; Value: 0
U41 = BGS13S4N9E6327XTSA1: No Description Available; Mfr_Name: Infineon; RefDes: RefDes; Type: Type
U42 = NX3L1T3157GM,115: No Description Available; Mfr_Name: NXP; RefDes: RefDes; Type: Type
U? = MCD-02018: Wideband RF SP3T Switch; Part_Type: IC; Manufacturer: INFINEON; ECCN_US: EAR99; ECCN_EU: tbd; Provided_By: SUBCO; Internal_Part_Number: MCD-02018; Status: Checked; Manufacturer_Part_Number: BGS13S4N9; Package: TSNP-9-3; ComponentLink1Description: Datasheet; ComponentLink1URL: http://tunmcdsvn.tun.st.com/Component_Datasheet_Library/Trunk/IC/Infineon_SP3T_BGS13S4N9/Infineon-BGS13S4N9-DS-v01_00-EN.pdf

## Nets that join several sheets
1V5: PowerElectronics (C143.2 P_test_1V5.2), Processor (U31.29 U31.45)
3V3: PowerElectronics (P_Test_3V3.2 U14.3 U14.4), AnalogParts (14 pins), Processor (6 pins), RF_antenna (U42.5)
GND: PowerElectronics (19 pins), AnalogParts (18 pins), Processor (11 pins), RF_antenna (22 pins)
FE_CTRL1: Processor (U31.12), RF_antenna (R402.1 U42.6)
FE_CTRL2: Processor (U31.13), RF_antenna (R401.1)
FE_CTRL3: Processor (U31.14), RF_antenna (R403.2)
Sg_Radio_RF0_HP: Processor (U31.23), RF_antenna (L423.1 L461.2)
Sg_Radio_RF0_LP: Processor (U31.22), RF_antenna (L413.1 L462.2)
Sg_Radio_RFI_N: Processor (U31.21), RF_antenna (C433.1 L431.1)
Sg_Radio_RFI_P: Processor (U31.20), RF_antenna (C432.2 L431.2)